# Altium schematic sheet Logique_Prio_Alim.SchDoc: LOGIQUE DE GESTION DES PRIORITES DES ALIMENTATIONS
size A4; Date: 14/04/2026; CheckedBy: P. FISCHER; Author: P. FISCHER; CompanyName: LE GROUPE DE 5; DrawnBy: P. FISCHER; DocumentNumber: SCH_CARTE_MONITORING_PERMANENT_0; Revision: A.0; SheetNumber: 2; SheetTotal: 7
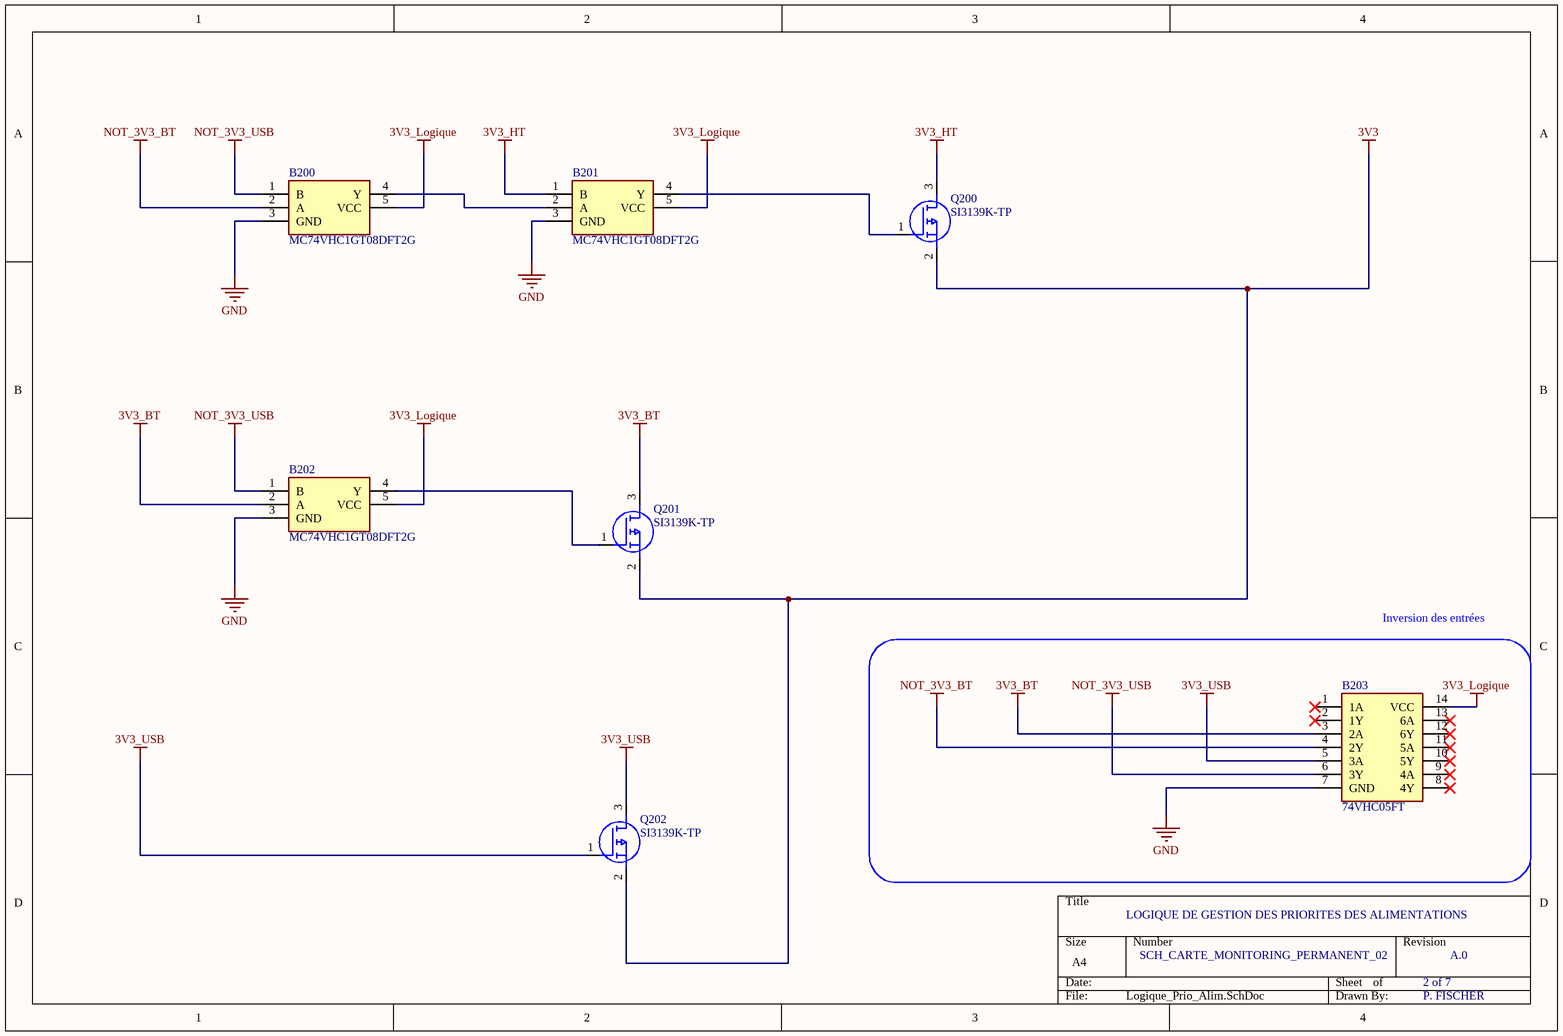
[diagram p0: Logique_Prio_Alim.SchDoc]

## Parts
B200  MC74VHC1GT08DFT2G  [SOT65P210X110-5N]
B201  MC74VHC1GT08DFT2G  [SOT65P210X110-5N]
B202  MC74VHC1GT08DFT2G  [SOT65P210X110-5N]
B203  74VHC05FT  [SOP65P640X120-14N]
Q200  SI3139K-TP  [SI3139K-TP]
Q201  SI3139K-TP  [SI3139K-TP]
Q202  SI3139K-TP  [SI3139K-TP]

## Blocks framed on the sheet
Inversion des entrées: B203

## Nets
3V3: Q200.2(S) Q201.2(S) Q202.2(S)
3V3_BT: B202.2(A) B203.3(2A) Q201.3(D)
3V3_HT: B201.1(B) Q200.3(D)
3V3_Logique: B200.5(VCC) B201.5(VCC) B202.5(VCC) B203.14(VCC)
3V3_USB: B203.5(3A) Q202.1(G) Q202.3(D)
GND: B200.3(GND) B201.3(GND) B202.3(GND) B203.7(GND)
NOT_3V3_BT: B200.2(A) B203.4(2Y)
NOT_3V3_USB: B200.1(B) B202.1(B) B203.6(3Y)
NetB200_4: B200.4(Y) B201.2(A)
NetB201_4: B201.4(Y) Q200.1(G)
NetB202_4: B202.4(Y) Q201.1(G)

Not connected (* = marked no-connect by the designer): B203 1(1A)* 2(1Y)* 8(4Y)* 9(4A)* 10(5Y)* 11(5A)* 12(6Y)* 13(6A)*

## Library data of the parts
B200-B202 = MC74VHC1GT08DFT2G: Single 2-Input AND Gate, TTL Level; Manufacturer_Name: onsemi; Manufacturer_Part_Number: MC74VHC1GT08DFT2G; Parameter 3: *
B203 = 74VHC05FT: Logic Gates CMOS LOGIC IC INVERTER; Manufacturer_Name: Toshiba; Manufacturer_Part_Number: 74VHC05FT; Mouser Part Number: 757-74VHC05FT
Q200-Q202 = SI3139K-TP: MOSFET P-Channel MOSFET